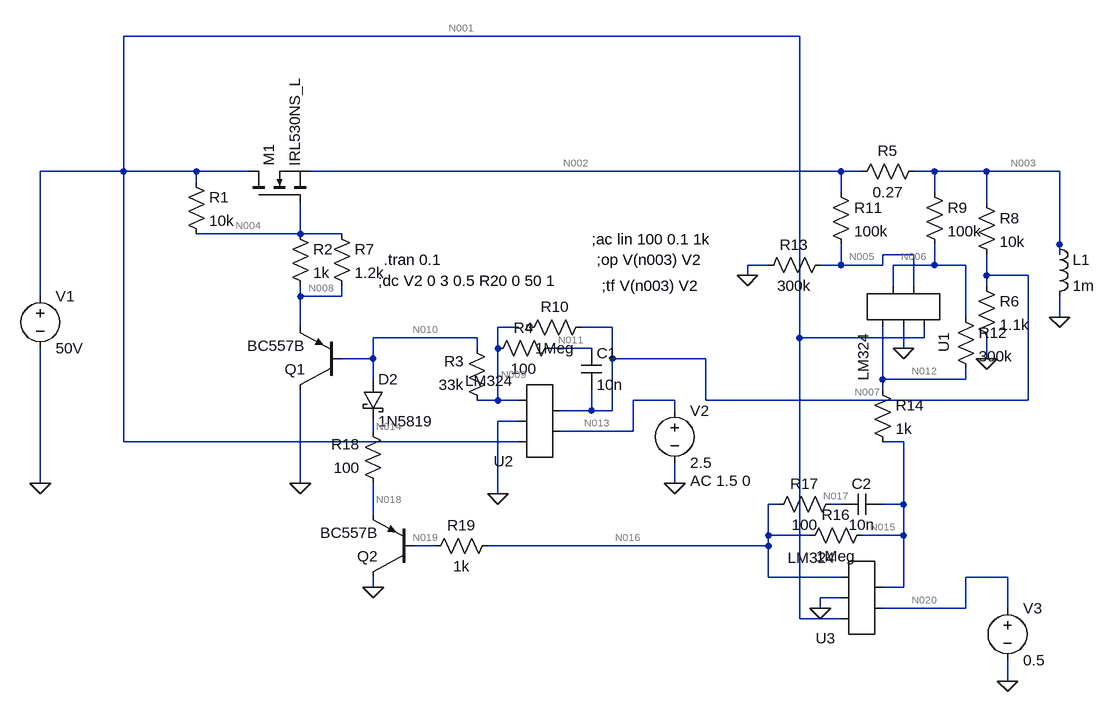
[diagram p0: schematic power01.asc]
* power01.asc
M1 N001 N004 N002 N002 IRL530NS_L
R1 N001 N004 10k
R2 N004 N008 1k
R3 N009 N010 33k
R4 N011 N009 100
C1 N011 N007 10n
R6 N007 0 1.1k
V1 N001 0 50V
V2 N013 0 2.5 AC 1.5 0
R7 N004 N008 1.2k
R10 N007 NC_01 1Meg
Q1 0 N010 N008 0 BC557B
* U2: LM324 (symbol AutoGenerated\LM324 not available, pins judged from their places): pin1=N013 pin2=N007 pin3=N001 pin4=0 pin5=N009
R8 N003 N007 10k
R5 N003 N002 0.27
R9 N003 N006 100k
R11 N002 N005 100k
* U1: LM324 (symbol AutoGenerated\LM324 not available, pins judged from their places): pin1=N005 pin2=N006 pin3=N001 pin4=0 pin5=N012
R12 N006 N012 300k
R13 N005 0 300k
* U3: LM324 (symbol AutoGenerated\LM324 not available, pins judged from their places): pin1=N020 pin2=N015 pin3=N001 pin4=0 pin5=N016
V3 N020 0 0.5
R16 N015 N016 1Meg
R17 N017 N016 100
C2 N015 N017 10n
D2 N010 N014 1N5819
R18 N018 N014 100
Q2 0 N019 N018 0 BC557B
R19 N016 N019 1k
R14 N012 N015 1k
L1 N003 0 1m Rser=20
.model D D
.lib standard.dio
.model NPN NPN
.model PNP PNP
.lib standard.bjt
.model NMOS NMOS
.model PMOS PMOS
.lib standard.mos
;dc V2 0 3 0.5 R20 0 50 1
.tran 0.1
;tf V(n003) V2
;op V(n003) V2
;ac lin 100 0.1 1k
.backanno
.end

* Results of the author's LTspice run, read from the files saved beside the schematic
* Operating Point, zero values left out:
*   V(n001) = 50 V
*   V(n004) = 14.69 V
*   V(n002) = 12.15 V
*   V(n008) = 12.77 V
*   V(n009) = 48.5 V
*   V(n010) = 12.12 V
*   V(n011) = 48.5 V
*   V(n007) = 1.188 V
*   V(n013) = 2.5 V
*   V(n003) = 11.98 V
*   V(n006) = 9.112 V
*   V(n005) = 9.111 V
*   V(n012) = 490.6 mV
*   V(n016) = 11.26 V
*   V(n015) = 501.4 mV
*   V(n020) = 500 mV
*   V(n017) = 11.26 V
*   V(n014) = 11.99 V
*   V(n018) = 11.88 V
*   V(n019) = 11.26 V
*   Ic(Q2) = -1.107 mA
*   Ib(Q2) = -2.217 µA
*   Ie(Q2) = 1.109 mA
*   Ic(Q1) = -3.524 mA
*   Ib(Q1) = -6.929 µA
*   Ie(Q1) = 3.531 mA
*   Id(M1) = 600.3 mA
*   Is(M1) = -600.3 mA
*   I(D2) = 1.109 mA
*   I(L1) = 599.2 mA
*   I(R14) = -10.78 µA
*   I(R19) = -2.217 µA
*   I(R18) = -1.109 mA
*   I(R16) = -10.76 µA
*   I(R13) = 30.37 µA
*   I(R12) = 28.74 µA
*   I(R11) = 30.35 µA
*   I(R9) = 28.72 µA
*   I(R5) = -600.3 mA
*   I(R8) = 1.08 mA
*   I(R7) = 1.605 mA
*   I(R6) = 1.08 mA
*   I(R3) = 1.102 mA
*   I(R2) = 1.926 mA
*   I(R1) = 3.531 mA
*   I(V3) = 22.76 nA
*   I(V2) = -3.178 pA
*   I(V1) = -608.8 mA
*   Ix(u2:1) = 3.178 pA
*   Ix(u2:2) = -44.64 nA
*   Ix(u2:3) = 1.651 mA
*   Ix(u2:4) = -1.661 mA
*   Ix(u2:5) = -1.102 mA
*   Ix(u1:1) = -21.8 nA
*   Ix(u1:2) = -21.24 nA
*   Ix(u1:3) = 1.66 mA
*   Ix(u1:4) = -1.66 mA
*   Ix(u1:5) = 39.52 µA
*   Ix(u3:1) = -22.76 nA
*   Ix(u3:2) = -22.02 nA
*   Ix(u3:3) = 1.66 mA
*   Ix(u3:4) = -1.661 mA
*   Ix(u3:5) = -8.542 µA
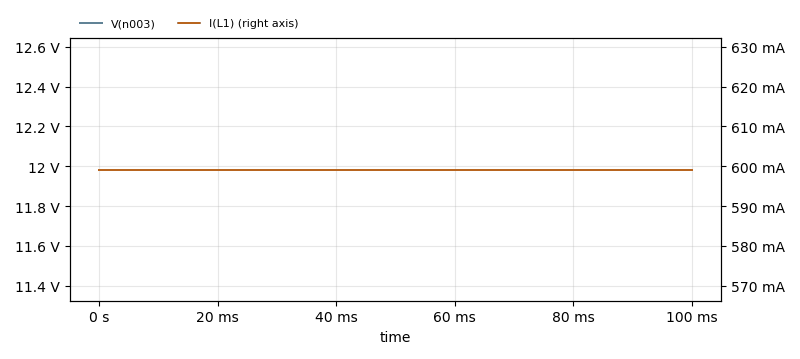
[diagram p1: Transient Analysis of power01.asc, plotted from the saved traces]
* Transient Analysis, 1 run:
*   V(n003): min 11.98 V, max 11.98 V, average 11.98 V, rms 11.98 V, last 11.98 V
*   I(L1): min 599.2 mA, max 599.2 mA, average 599.2 mA, rms 599.2 mA, last 599.2 mA